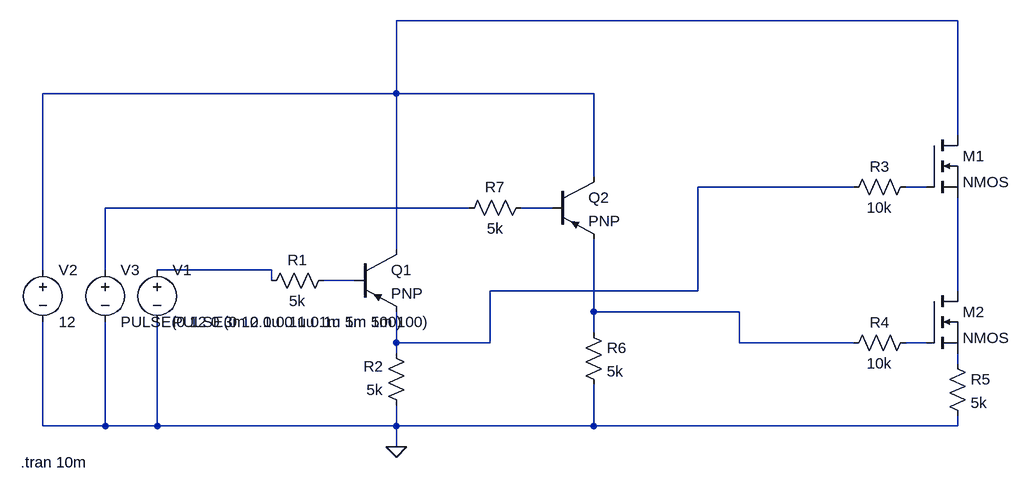
[diagram p0: schematic Inductive limit switch interface.asc]
Inductive limit switch interface.asc, the LTspice schematic file:
Version 4
SHEET 1 1108 680
WIRE 1024 -272 160 -272
WIRE 160 -160 160 -272
WIRE 160 -160 -384 -160
WIRE 464 -160 160 -160
WIRE 1024 -96 1024 -272
WIRE 464 -32 464 -160
WIRE 864 -16 624 -16
WIRE 976 -16 944 -16
WIRE 272 16 -288 16
WIRE 400 16 352 16
WIRE 160 80 160 -160
WIRE -384 112 -384 -160
WIRE -288 112 -288 16
WIRE -32 112 -208 112
WIRE -32 128 -32 112
WIRE 96 128 48 128
WIRE 624 144 624 -16
WIRE 624 144 304 144
WIRE 1024 144 1024 0
WIRE 464 176 464 64
WIRE 688 176 464 176
WIRE 464 208 464 176
WIRE 160 224 160 176
WIRE 304 224 304 144
WIRE 304 224 160 224
WIRE 688 224 688 176
WIRE 864 224 688 224
WIRE 976 224 944 224
WIRE 160 240 160 224
WIRE 1024 256 1024 240
WIRE -384 352 -384 192
WIRE -288 352 -288 192
WIRE -288 352 -384 352
WIRE -208 352 -208 192
WIRE -208 352 -288 352
WIRE 160 352 160 320
WIRE 160 352 -208 352
WIRE 464 352 464 288
WIRE 464 352 160 352
WIRE 1024 352 1024 336
WIRE 1024 352 464 352
WIRE 160 384 160 352
FLAG 160 384 0
SYMBOL pnp 96 80 R0
SYMATTR InstName Q1
SYMBOL res 64 112 R90
WINDOW 0 0 56 VBottom 2
WINDOW 3 32 56 VTop 2
SYMATTR InstName R1
SYMATTR Value 5k
SYMBOL res 176 336 R180
WINDOW 0 36 76 Left 2
WINDOW 3 36 40 Left 2
SYMATTR InstName R2
SYMATTR Value 5k
SYMBOL voltage -208 96 R0
WINDOW 123 0 0 Left 0
WINDOW 39 0 0 Left 0
SYMATTR InstName V1
SYMATTR Value PULSE(0 12 0 0.1u 0.1u 1m 5m 100)
SYMBOL voltage -384 96 R0
WINDOW 123 0 0 Left 0
WINDOW 39 0 0 Left 0
SYMATTR InstName V2
SYMATTR Value 12
SYMBOL res 960 -32 R90
WINDOW 0 0 56 VBottom 2
WINDOW 3 32 56 VTop 2
SYMATTR InstName R3
SYMATTR Value 10k
SYMBOL res 960 208 R90
WINDOW 0 0 56 VBottom 2
WINDOW 3 32 56 VTop 2
SYMATTR InstName R4
SYMATTR Value 10k
SYMBOL nmos 976 -96 R0
SYMATTR InstName M1
SYMBOL nmos 976 144 R0
SYMATTR InstName M2
SYMBOL pnp 400 -32 R0
SYMATTR InstName Q2
SYMBOL res 448 192 R0
SYMATTR InstName R6
SYMATTR Value 5k
SYMBOL voltage -288 96 R0
WINDOW 123 0 0 Left 0
WINDOW 39 0 0 Left 0
SYMATTR InstName V3
SYMATTR Value PULSE(0 12 0.3m 0.1u 0.1u 1m 5m 100)
SYMBOL res 368 0 R90
WINDOW 0 0 56 VBottom 2
WINDOW 3 32 56 VTop 2
SYMATTR InstName R7
SYMATTR Value 5k
SYMBOL res 1008 240 R0
SYMATTR InstName R5
SYMATTR Value 5k
TEXT -418 408 Left 2 !.tran 10m

The netlist it stands for:
* Inductive limit switch interface.asc
Q1 N001 N007 N002 0 PNP
R1 N007 N006 5k
R2 0 N002 5k
V1 N006 0 PULSE(0 12 0 0.1u 0.1u 1m 5m 100)
V2 N001 0 12
R3 N003 N002 10k
R4 N010 N009 10k
M1 N001 N003 N008 N008 NMOS
M2 N008 N010 N011 N011 NMOS
Q2 N001 N005 N009 0 PNP
R6 N009 0 5k
V3 N004 0 PULSE(0 12 0.3m 0.1u 0.1u 1m 5m 100)
R7 N005 N004 5k
R5 N011 0 5k
.model NPN NPN
.model PNP PNP
.lib standard.bjt
.model NMOS NMOS
.model PMOS PMOS
.lib standard.mos
.tran 10m
.backanno
.end